# Altium schematic sheet Power Network.SchDoc: Power Port
size A4
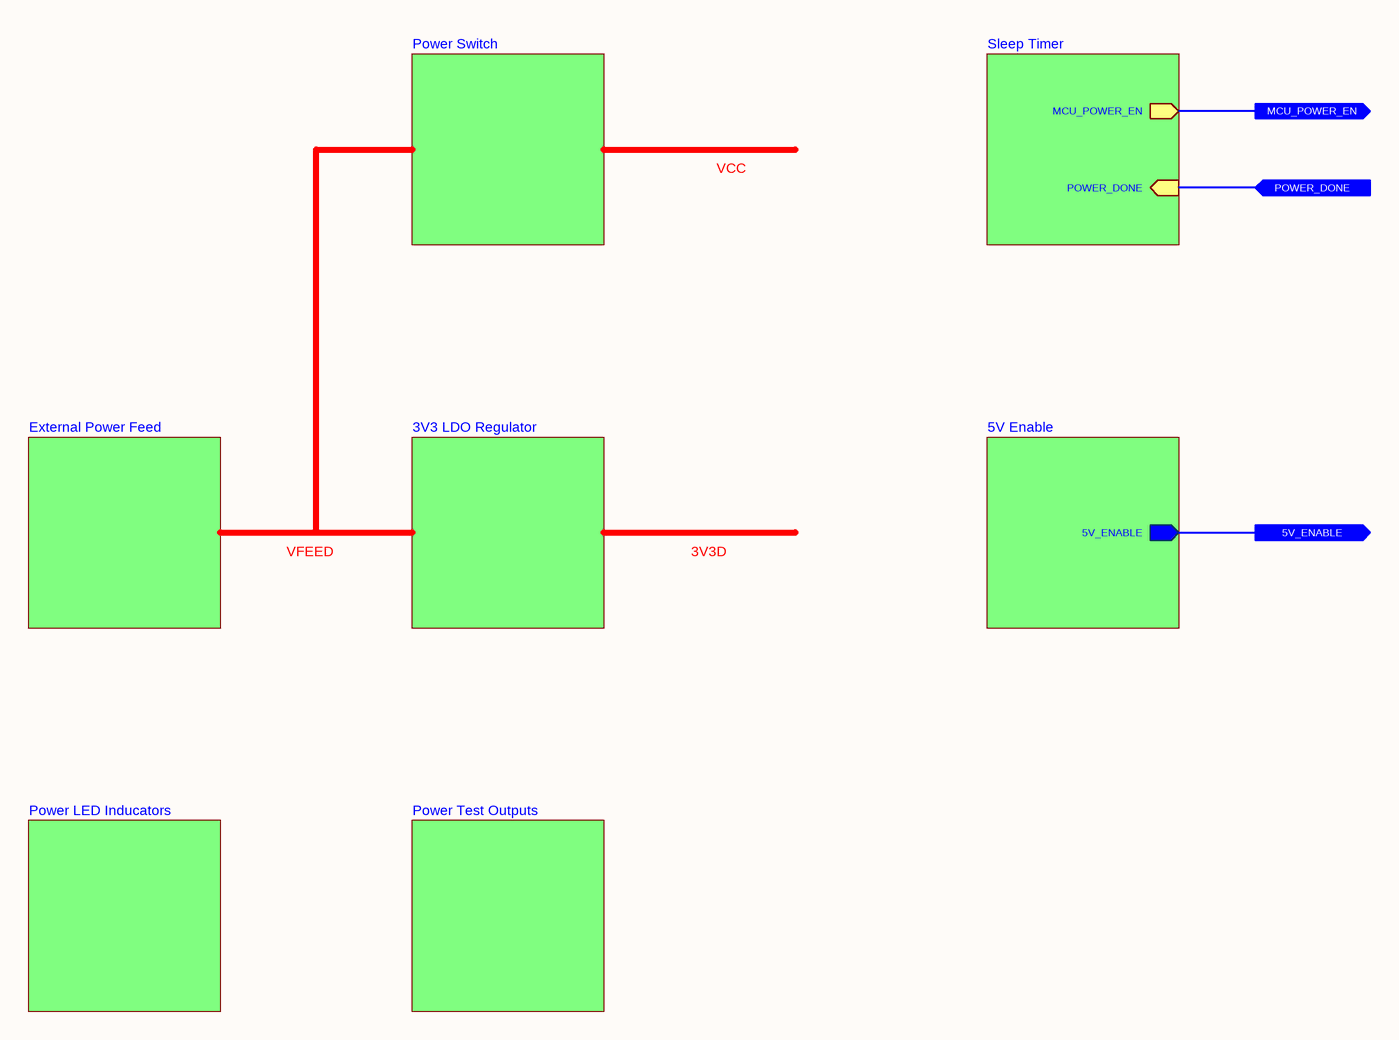
[diagram p0: Power Network.SchDoc]

## Sub-sheets
3V3 LDO Regulator = 3V3 LDO Regulator.SchDoc: no entries
5V Enable = 5V Enable.SchDoc: 5V_ENABLE (out)
External Power Feed = External Power Feed.SchDoc: no entries
Power LED Inducators = Power LED Inducators.SchDoc: no entries
Power Switch = Power Switch.SchDoc: no entries
Power Test Outputs = Power Test Pins.SchDoc: no entries
Sleep Timer = Sleep Timer.SchDoc: MCU_POWER_EN (out), POWER_DONE (in)

## Ports
5V_ENABLE (out), MCU_POWER_EN (out), POWER_DONE (in)

## Nets
5V_ENABLE: port 5V_ENABLE, sheet 5V Enable/5V_ENABLE
MCU_POWER_EN: port MCU_POWER_EN, sheet Sleep Timer/MCU_POWER_EN
POWER_DONE: port POWER_DONE, sheet Sleep Timer/POWER_DONE

## Notes on the sheet
- VCC
- VFEED
- 3V3D
- Title
- Size:
- Date:
- A4
- Number:
- Time:
- Revision:
- Sheet
- of
- File: